# Altium schematic sheet diff2singleEnded.SchDoc
size A4; SheetNumber: 2; SheetTotal: 2
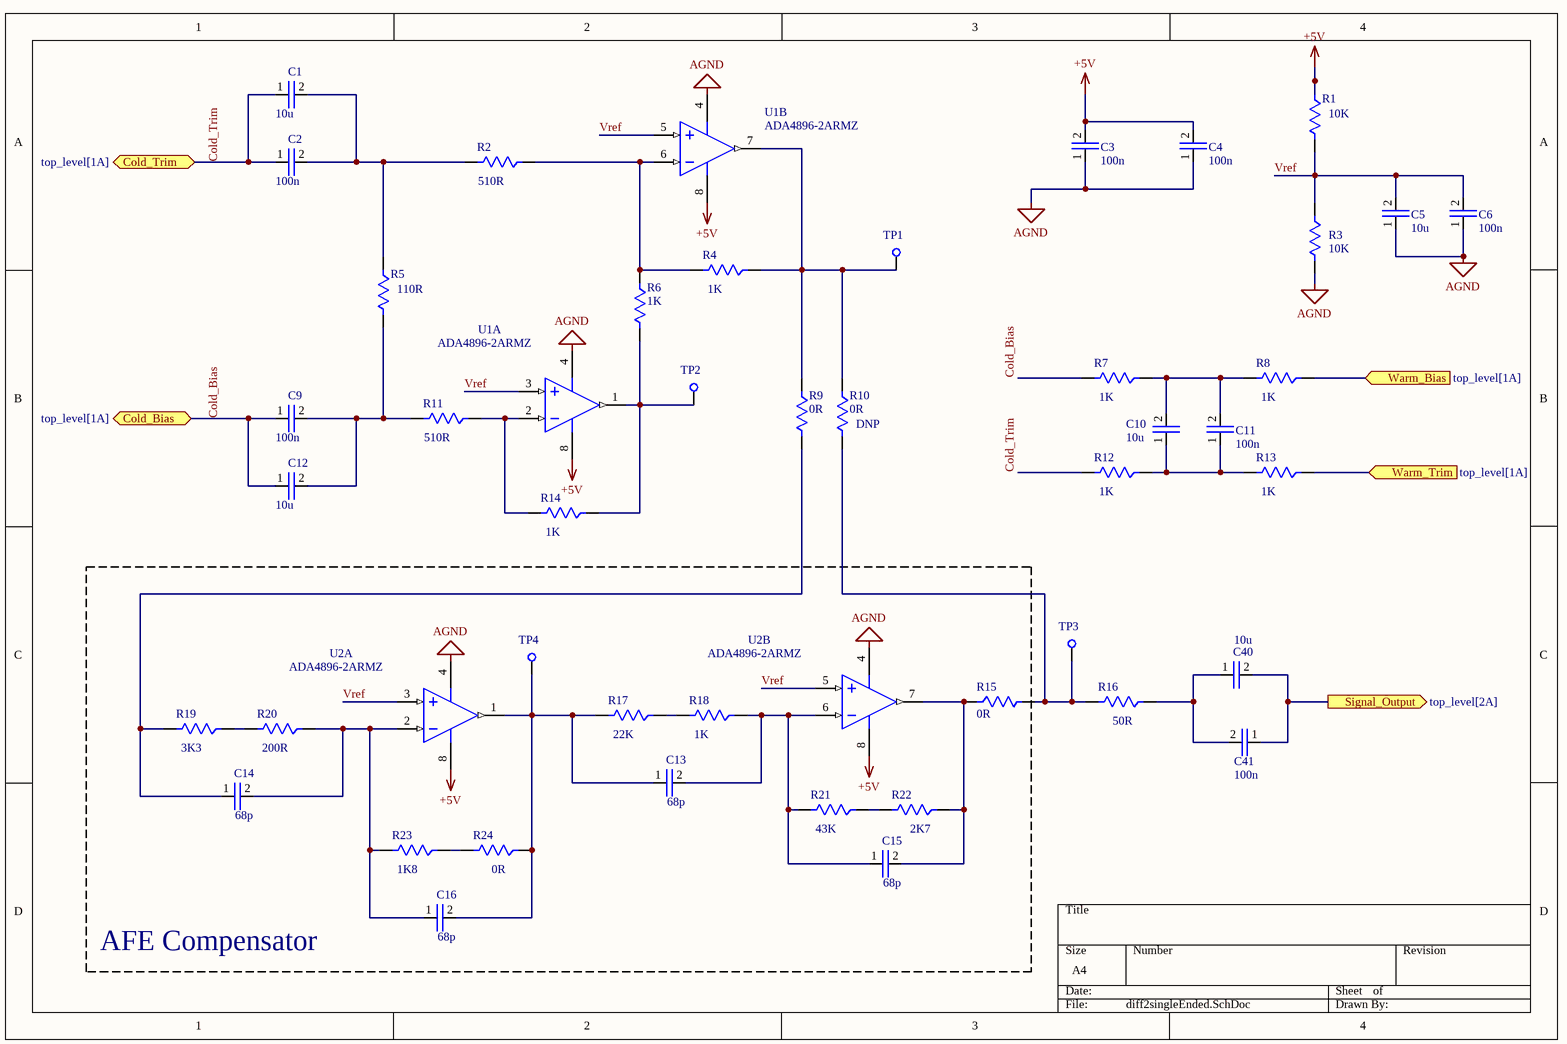
[diagram p0: diff2singleEnded.SchDoc]

## Parts
C1  value 10u  [CAPC3216X190N]  (hidden comment: C3216X6S2A106K160AC)
C2  value 100n  [CAPC1608X09N]  (hidden comment: CC0603KRX7R0BB104)
C3  value 100n  [CAPC1608X09N]  (hidden comment: CC0603KRX7R0BB104)
C4  value 100n  [CAPC1608X09N]  (hidden comment: CC0603KRX7R0BB104)
C5  value 10u  [CAPC3216X190N]  (hidden comment: CL31A106KPHNNNE)
C6  value 100n  [CAPC1608X09N]  (hidden comment: CC0603KRX7R0BB104)
C9  value 100n  [CAPC1608X09N]  (hidden comment: CC0603KRX7R0BB104)
C10  value 10u  [CAPC3216X190N]  (hidden comment: C3216X6S2A106K160AC)
C11  value 100n  [CAPC1608X09N]  (hidden comment: CC0603KRX7R0BB104)
C12  value 10u  [CAPC3216X190N]  (hidden comment: C3216X6S2A106K160AC)
C13  value 68p  [CAPC1608X09N]  (hidden comment: GCM1885C2A680FA16D)
C14  value 68p  [CAPC1608X09N]  (hidden comment: GCM1885C2A680FA16D)
C15  value 68p  [CAPC1608X09N]  (hidden comment: GCM1885C2A680FA16D)
C16  value 68p  [CAPC1608X09N]  (hidden comment: GCM1885C2A680FA16D)
C40  value 10u  [CAPC1608X09N]  (hidden comment: CL10A106KP8NNNC)
C41  value 100n  [CAPC1608X09N]  (hidden comment: CC0603KRX7R0BB104)
R1  value 10K  [RESC1608X55N]  (hidden comment: RC0603FR-0710KL)
R2  value 510R  [RESC1608X55N]  (hidden comment: RT0603BRD07510RL)
R3  value 10K  [RESC1608X55N]  (hidden comment: RC0603FR-0710KL)
R4  value 1K  [RESC1608X55N]  (hidden comment: RT0603BRD071KL)
R5  value 110R  [RESC1608X55N]  (hidden comment: RT0603BRD07110RL)
R6  value 1K  [RESC1608X55N]  (hidden comment: RT0603BRD071KL)
R7  value 1K  [RESC1608X55N]  (hidden comment: RT0603BRD071KL)
R8  value 1K  [RESC1608X55N]  (hidden comment: RT0603BRD071KL)
R9  value 0R  [RESC1608X55N]  (hidden comment: RMCF0603ZT0R00)
R10  DNP  value 0R  [RESC1608X55N]
R11  value 510R  [RESC1608X55N]  (hidden comment: RT0603BRD07510RL)
R12  value 1K  [RESC1608X55N]  (hidden comment: RT0603BRD071KL)
R13  value 1K  [RESC1608X55N]  (hidden comment: RT0603BRD071KL)
R14  value 1K  [RESC1608X55N]  (hidden comment: RT0603BRD071KL)
R15  value 0R  [RESC1608X55N]  (hidden comment: RMCF0603ZT0R00)
R16  value 50R  [RESC1608X55N]  (hidden comment: RT0603BRE0750RL)
R17  value 22K  [RESC1608X55N]  (hidden comment: RT0603BRE0722KL)
R18  value 1K  [RESC1608X55N]  (hidden comment: RT0603BRD071KL)
R19  value 3K3  [RESC1608X55N]  (hidden comment: RT0603BRD073K3L)
R20  value 200R  [RESC1608X55N]  (hidden comment: RT0603BRD07200RL)
R21  value 43K  [RESC1608X55N]  (hidden comment: RT0603BRD0743KL)
R22  value 2K7  [RESC1608X55N]  (hidden comment: RT0603BRD072K7L)
R23  value 1K8  [RESC1608X55N]  (hidden comment: RT0603BRD071K8L)
R24  value 0R  [RESC1608X55N]  (hidden comment: RMCF0603ZT0R00)
TP1  testPoint  [testPoint_pad]  (value not drawn)
TP2  testPoint  [testPoint_pad]  (value not drawn)
TP3  testPoint  [testPoint_pad]  (value not drawn)
TP4  testPoint  [testPoint_pad]  (value not drawn)
U1  ADA4896-2ARMZ  [ADI-RM-8_N]  (parts A,B of 2)
U2  ADA4896-2ARMZ  [ADI-RM-8_N]  (parts A,B of 2)

## Blocks framed on the sheet
AFE Compensator: C13-C16 R15 R17-R24 TP4 U2

## Ports
Cold_Bias (bidir, see top_level[1A]), Cold_Trim (bidir, see top_level[1A]), Signal_Output (out, see top_level[2A]), Warm_Bias (in, see top_level[1A]), Warm_Trim (in, see top_level[1A])

## Nets
+5V: C3.2 C4.2 R1.2 U1.8(+VS) U2.8(+VS)
AGND: C3.1 C4.1 C5.1 C6.1 R3.1 U1.4(-VS) U2.4(-VS)
Cold_Bias: C9.1 C12.1 R7.1 ; port Cold_Bias
Cold_Trim: C1.1 C2.1 R12.1 ; port Cold_Trim
Signal_Output: C40.2 C41.1 ; port Signal_Output
Vref: C5.2 C6.2 R1.1 R3.2 U1.3(+IN_1) U1.5(+IN_2) U2.3(+IN_1) U2.5(+IN_2)
Warm_Bias: R8.2 ; port Warm_Bias
Warm_Trim: R13.2 ; port Warm_Trim
NetC1_2: C1.2 C2.2 R2.1 R5.2
NetC9_2: C9.2 C12.2 R5.1 R11.1
NetC10_1: C10.1 C11.1 R12.2 R13.1
NetC10_2: C10.2 C11.2 R7.2 R8.1
NetC13_1: C13.1 C16.2 R17.1 R24.2 TP4.0 U2.1(OUT_1)
NetC13_2: C13.2 C15.1 R18.2 R21.1 U2.6(-IN_2)
NetC14_1: C14.1 R9.1 R19.1
NetC14_2: C14.2 C16.1 R20.2 R23.1 U2.2(-IN_1)
NetC15_2: C15.2 R15.2 R22.2 U2.7(OUT_2)
NetC40_1: C40.1 C41.2 R16.2
NetR2_2: R2.2 R4.1 R6.2 U1.6(-IN_2)
NetR4_2: R4.2 R9.2 R10.2 TP1.0 U1.7(OUT_2)
NetR6_1: R6.1 R14.2 TP2.0 U1.1(OUT_1)
NetR10_1: R10.1 R15.1 R16.1 TP3.0
NetR11_2: R11.2 R14.1 U1.2(-IN_1)
NetR17_2: R17.2 R18.1
NetR19_2: R19.2 R20.1
NetR21_2: R21.2 R22.1
NetR23_2: R23.2 R24.1

## Library data of the parts
C1 C10 C12 = Capacitor: 10 µF ±10% 100V Ceramic Capacitor X6S 1206 (3216 Metric); MP: C3216X6S2A106K160AC
C2-C4 C6 C9 C11 C41 = Capacitor: 0.1 µF ±10% 100V Ceramic Capacitor X7R 0603 (1608 Metric); MP: CC0603KRX7R0BB104
C5 = Capacitor: 10 µF ±10% 10V Ceramic Capacitor X5R 1206 (3216 Metric); MP: CL31A106KPHNNNE
C13-C16 = Capacitor: 68 pF ±1% 100V Ceramic Capacitor C0G, NP0 0603 (1608 Metric); MP: GCM1885C2A680FA16D
C40 = Capacitor: 10 µF ±10% 10V Ceramic Capacitor X5R 0603 (1608 Metric); MP: CL10A106KP8NNNC
R1 R3 = Resistor: 10 kOhms ±1% 0.1W, 1/10W Chip Resistor 0603 (1608 Metric) Moisture Resistant Thick Film; Package: None; Price: None; MP: RC0603FR-0710KL; Availability: Unavailable
R2 R11 = Resistor: 510 Ohms ±0.1% 0.1W, 1/10W Chip Resistor 0603 (1608 Metric) Thin Film; Package: None; Price: None; MP: RT0603BRD07510RL; Availability: Unavailable
  R2: Manufacturer 1: *
R4 R6-R8 R12-R14 R18 = Resistor: 1 kOhms ±0.1% 0.1W, 1/10W Chip Resistor 0603 (1608 Metric) Thin Film; Package: None; Price: None; MP: RT0603BRD071KL; Availability: Unavailable
R5 = Resistor: 110 Ohms ±0.1% 0.1W, 1/10W Chip Resistor 0603 (1608 Metric) Thin Film; Package: None; Price: None; MP: RT0603BRD07110RL; Availability: Unavailable
R9 R15 R24 = Resistor: 0 Ohms Jumper Chip Resistor 0603 (1608 Metric) Automotive AEC-Q200 Thick Film; Package: None; Price: None; MP: RMCF0603ZT0R00; Availability: Unavailable
R10 = Resistor: 0 Ohms Jumper Chip Resistor 0603 (1608 Metric) Automotive AEC-Q200 Thick Film; MP: RMCF0603ZT0R00; Package: None; Price: None; Availability: Unavailable
R16 = Resistor: 50 Ohms ±0.1% 0.1W, 1/10W Chip Resistor 0603 (1608 Metric) Thin Film; Package: None; Price: None; MP: RT0603BRE0750RL; Availability: Unavailable
R17 = Resistor: 22 kOhms ±0.1% 0.1W, 1/10W Chip Resistor 0603 (1608 Metric) Thin Film; Package: None; Price: None; MP: RT0603BRE0722KL; Availability: Unavailable
R19 = Resistor: 3.3 kOhms ±0.1% 0.1W, 1/10W Chip Resistor 0603 (1608 Metric) Thin Film; Package: None; Price: None; MP: RT0603BRD073K3L; Availability: Unavailable
R20 = Resistor: 200 Ohms ±0.1% 0.1W, 1/10W Chip Resistor 0603 (1608 Metric) Thin Film; Package: None; Price: None; MP: RT0603BRD07200RL; Availability: Unavailable
R21 = Resistor: 43 kOhms ±0.1% 0.1W, 1/10W Chip Resistor 0603 (1608 Metric) Thin Film; Package: None; Price: None; MP: RT0603BRD0743KL; Availability: Unavailable
R22 = Resistor: 2.7 kOhms ±0.1% 0.1W, 1/10W Chip Resistor 0603 (1608 Metric) Thin Film; Package: None; Price: None; MP: RT0603BRD072K7L; Availability: Unavailable
R23 = Resistor: 1.8 kOhms ±0.1% 0.1W, 1/10W Chip Resistor 0603 (1608 Metric) Thin Film; Package: None; Price: None; MP: RT0603BRD071K8L; Availability: Unavailable
U1 U2 = CMP-0384-01715-1: Double Channel Low Wide Band Noise Operational Amplifier, 230 MHz BW, 120 V/us SR, Industrial, 8-pin SOP (RM-8), Tube; Manufacturer: Analog Devices; Amplifiers Per Package: 2; Iq/Amp: 3mA; Input Bias Current: 11uA; Small Signal Bandwidth: 230MHz; Input Offset Voltage: 28uV; V Span Min: 3V; V Span Max: 10V; Packing: Tube; Code_JEDEC: MO-187-AA; PartNumber: ADA4896-2ARMZ; PackageReference: RM-8; Slew Rate: 120V/us; Generic Part Number: ADA4896-2; ComponentLink3URL: http://www.analog.com/static/imported-files/packages/PKG_PDF/MSOP%28RM%29/RM_8.pdf; ComponentLink3Description: Package Specification; ComponentLink1Description: Manufacturer URL; ComponentLink2URL: http://www.analog.com/static/imported-files/data_sheets/ADA4896-2_4897-1_4897-2.PDF; DatasheetVersion: Rev. B; ComponentLink1URL: http://www.analog.com/en/index.html; PackageDescription: 8-Pin Mini Small Outline Package, Body 3 x 3 mm, Pitch 0.65 mm; Mounting Technology: Surface Mount; ComponentLink2Description: Datasheet